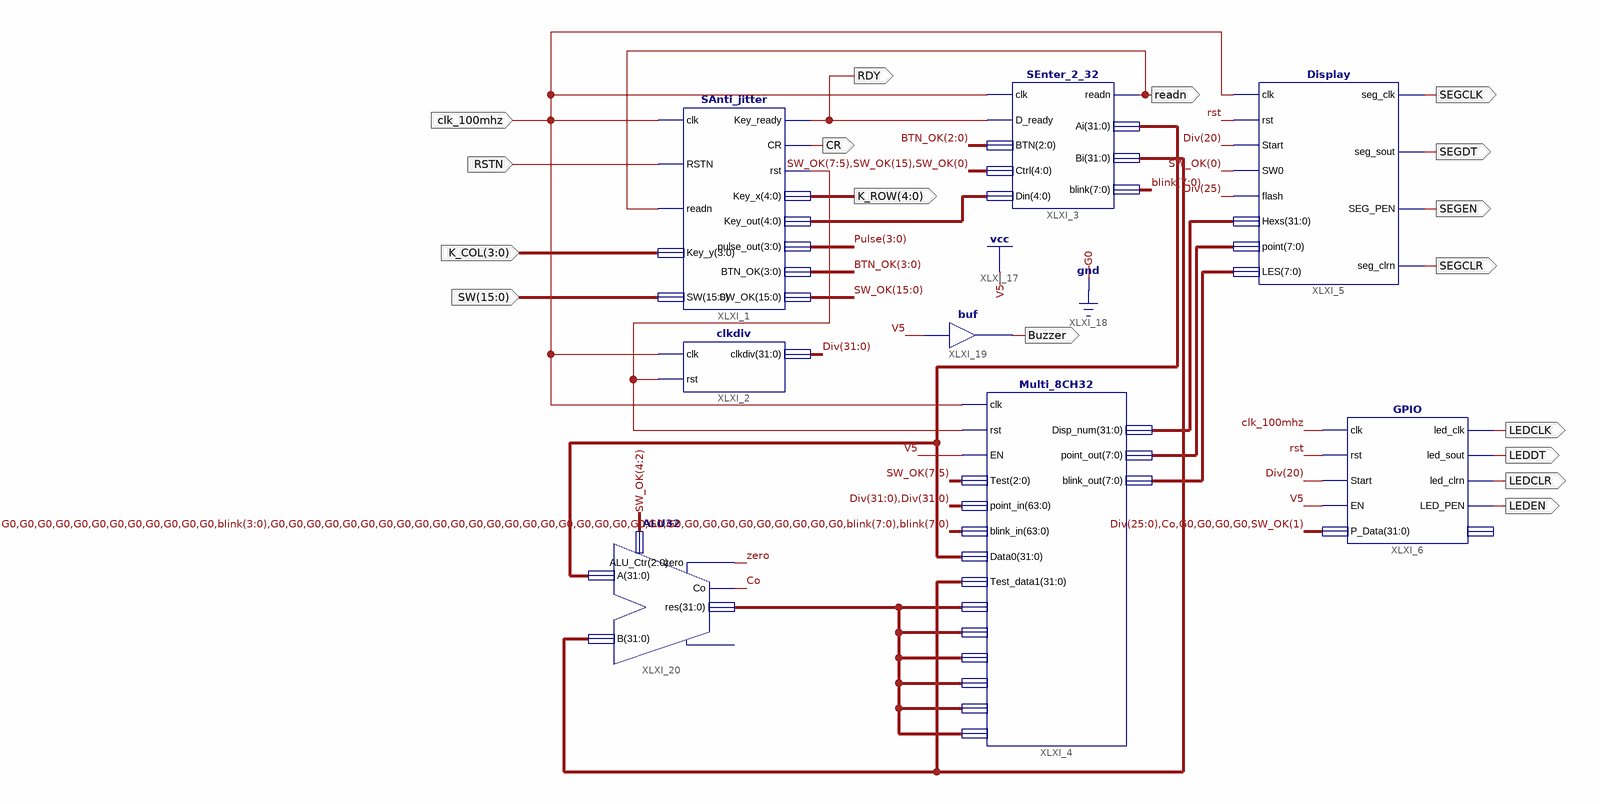
[diagram p0: schematic sheet 1]
// Xilinx ISE schematic exp82.sch (kintex7) as structural Verilog: 8 symbols, 17 ports
module exp82 (
  input  RSTN,
  input  [3:0] K_COL,
  input  [15:0] SW,
  input  clk_100mhz,
  output [4:0] K_ROW,
  output CR,
  output RDY,
  output SEGCLK,
  output SEGDT,
  output SEGEN,
  output SEGCLR,
  output readn,
  output LEDCLK,
  output LEDDT,
  output LEDEN,
  output Buzzer,
  output LEDCLR
);

  wire Co, rst, XLXN_9, zero;
  wire [3:0] BTN_OK, Pulse;
  wire [4:0] XLXN_15;
  wire [7:0] blink, XLXN_36, XLXN_37;
  wire [15:0] SW_OK;
  wire [31:0] Div, s, XLXN_35, XLXN_43, XLXN_44;

  SAnti_jitter XLXI_1 (
    .clk(clk_100mhz), .RSTN(RSTN), .readn(readn), .Key_y(K_COL), .SW(SW), .Key_ready(RDY), .CR(CR),
    .rst(XLXN_9), .Key_x(K_ROW), .Key_out(XLXN_15), .pulse_out(Pulse), .BTN_OK(BTN_OK), .SW_OK(SW_OK));
  clkdiv XLXI_2 (.clk(clk_100mhz), .rst(XLXN_9), .clkdiv(Div));
  SEnter_2_32 XLXI_3 (
    .clk(clk_100mhz), .D_ready(RDY), .BTN(BTN_OK[2:0]), .Ctrl({SW_OK[7:5], SW_OK[15], SW_OK[0]}),
    .Din(XLXN_15), .readn(readn), .Ai(XLXN_43), .Bi(XLXN_44), .blink(blink));
  Multi_8CH32 XLXI_4 (
    .clk(clk_100mhz), .rst(XLXN_9), .EN(1'b1), .Test(SW_OK[7:5]), .point_in({Div, Div}),
    .blink_in({{12{1'b0}}, blink[3:0], {32{1'b0}}, blink, blink}), .Data0(XLXN_43), .Test_data1(XLXN_44),
    .Test_data2(s), .Test_data3(s), .Test_data4(s), .Test_data5(s), .Test_data6(s), .Test_data7(s),
    .Disp_num(XLXN_35), .blink_out(XLXN_37), .point_out(XLXN_36));
  Display XLXI_5 (
    .clk(clk_100mhz), .rst(rst), .Start(Div[20]), .SW0(SW_OK[0]), .flash(Div[25]), .Hexs(XLXN_35),
    .point(XLXN_36), .LES(XLXN_37), .seg_clk(SEGCLK), .seg_sout(SEGDT), .SEG_PEN(SEGEN), .seg_clrn(SEGCLR));
  GPIO XLXI_6 (
    .clk(clk_100mhz), .rst(rst), .Start(Div[20]), .EN(1'b1), .P_Data({Div[25:0], Co, 4'b0000, SW_OK[1]}),
    .led_clk(LEDCLK), .led_sout(LEDDT), .led_clrn(LEDCLR), .LED_PEN(LEDEN));  // open: GPIOf0
  buf XLXI_19 (Buzzer, 1'b1);
  ALU32 XLXI_20 (.A(XLXN_43), .B(XLXN_44), .ALU_Ctr(SW_OK[4:2]), .Co(Co), .zero(zero), .res(s));  // open: overflow
endmodule
